# Altium schematic sheet CABLE_MOTOR_DRIVERS.SchDoc
size A; SheetNumber: 2; SheetTotal: 6
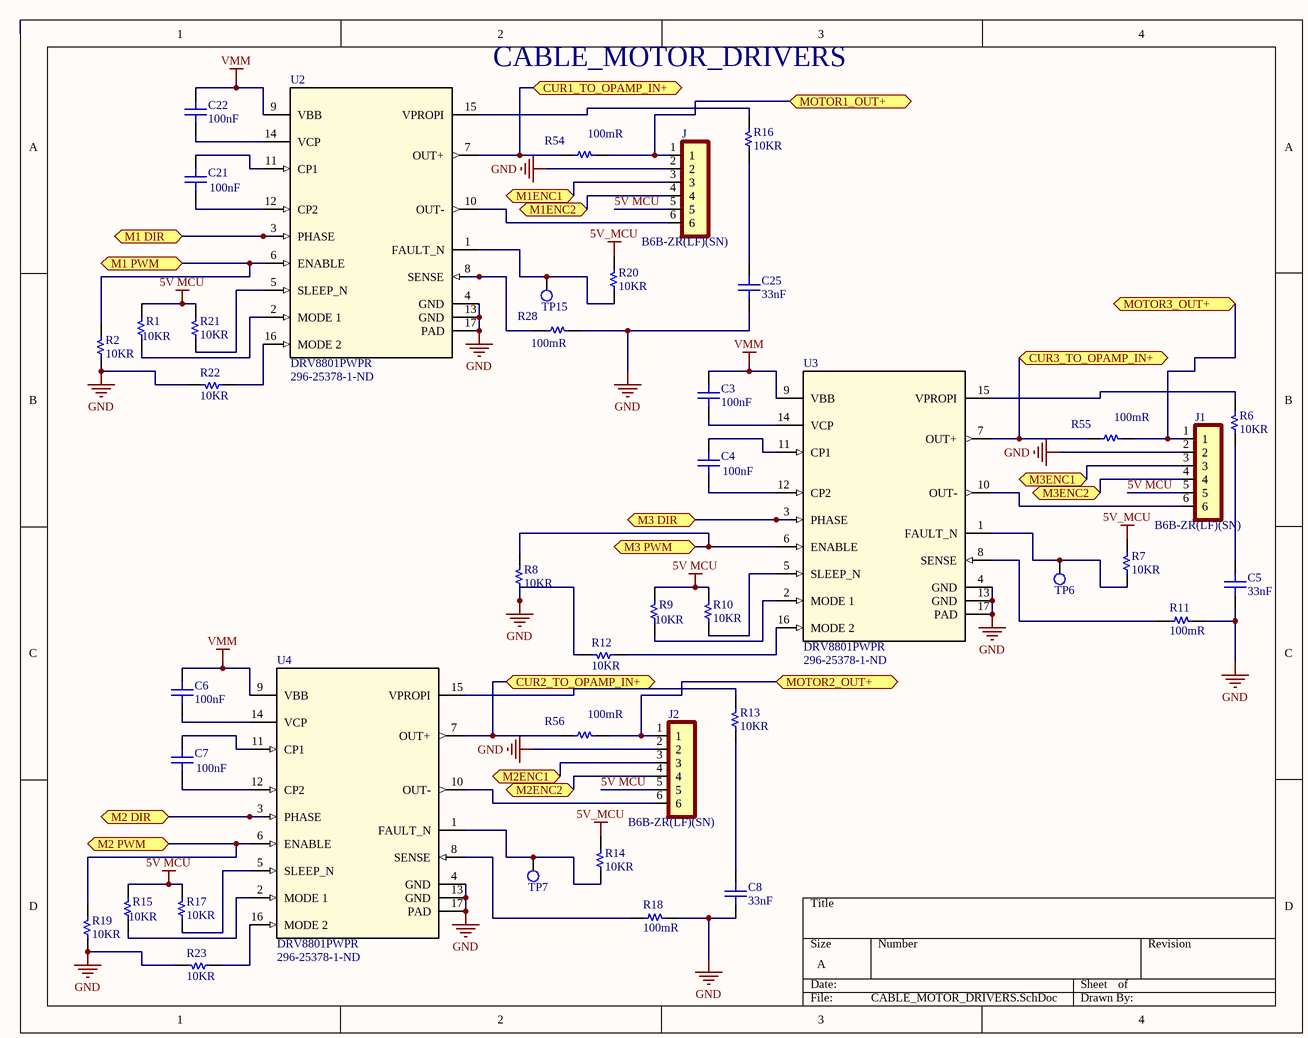
[diagram p0: CABLE_MOTOR_DRIVERS.SchDoc]

## Parts
C3  100nF  [CAP_ADJ_0805]
C4  100nF  [CAP_ADJ_0805]
C5  33nF  [CAP_ADJ_0805]
C6  100nF  [CAP_ADJ_0805]
C7  100nF  [CAP_ADJ_0805]
C8  33nF  [CAP_ADJ_0805]
C21  100nF  [CAP_ADJ_0805]
C22  100nF  [CAP_ADJ_0805]
C25  33nF  [CAP_ADJ_0805]
J  B6B-ZR(LF)(SN)  [JST_B6B-ZR(LF)(SN)]
J1  B6B-ZR(LF)(SN)  [JST_B6B-ZR(LF)(SN)]
J2  B6B-ZR(LF)(SN)  [JST_B6B-ZR(LF)(SN)]
R1  10KR  [RES_ADJ_0805_YAGEO]
R2  10KR  [RES_ADJ_0805_YAGEO]
R6  10KR  [RES_ADJ_0805_YAGEO]
R7  10KR  [RES_ADJ_0805_YAGEO]
R8  10KR  [RES_ADJ_0805_YAGEO]
R9  10KR  [RES_ADJ_0805_YAGEO]
R10  10KR  [RES_ADJ_0805_YAGEO]
R11  100mR  [RES_ADJ_0805_YAGEO]
R12  10KR  [RES_ADJ_0805_YAGEO]
R13  10KR  [RES_ADJ_0805_YAGEO]
R14  10KR  [RES_ADJ_0805_YAGEO]
R15  10KR  [RES_ADJ_0805_YAGEO]
R16  10KR  [RES_ADJ_0805_YAGEO]
R17  10KR  [RES_ADJ_0805_YAGEO]
R18  100mR  [RES_ADJ_0805_YAGEO]
R19  10KR  [RES_ADJ_0805_YAGEO]
R20  10KR  [RES_ADJ_0805_YAGEO]
R21  10KR  [RES_ADJ_0805_YAGEO]
R22  10KR  [RES_ADJ_0805_YAGEO]
R23  10KR  [RES_ADJ_0805_YAGEO]
R28  100mR  [RES_ADJ_0805_YAGEO]
R54  100mR  [RES_ADJ_0805_YAGEO]
R55  100mR  [RES_ADJ_0805_YAGEO]
R56  100mR  [RES_ADJ_0805_YAGEO]
TP6  TEST_POINT  [TEST_POINT]  (value not drawn)
TP7  TEST_POINT  [TEST_POINT]  (value not drawn)
TP15  TEST_POINT  [TEST_POINT]  (value not drawn)
U2  DRV8801PWPR  Supplier Part Number 1: 296-25378-1-ND  [PWP0016B_N]
U3  DRV8801PWPR  Supplier Part Number 1: 296-25378-1-ND  [PWP0016B_N]
U4  DRV8801PWPR  Supplier Part Number 1: 296-25378-1-ND  [PWP0016B_N]

## Ports
CUR1_TO_OPAMP_IN+ (bidir), CUR2_TO_OPAMP_IN+ (bidir), CUR3_TO_OPAMP_IN+ (bidir), M1 DIR (bidir), M1 PWM (bidir), M1ENC1 (bidir), M1ENC2 (bidir), M2 DIR (bidir), M2 PWM (bidir), M2ENC1 (bidir), M2ENC2 (bidir), M3 DIR (bidir), M3 PWM (bidir), M3ENC1 (bidir), M3ENC2 (bidir), MOTOR1_OUT+ (bidir), MOTOR2_OUT+ (bidir), MOTOR3_OUT+ (bidir)

## Nets
5V MCU: J.5 J1.5 J2.5 R1.2 R9.2 R10.2 R15.2 R17.2 R21.2
5V_MCU: R7.2 R14.2 R20.2
GND: C5.1 C8.1 C25.1 J.2 J1.2 J2.2 R2.1 R8.1 R11.2 R12.2 R18.2 R19.1 R22.2 R23.2 R28.2 U2.4(GND) U2.13(GND) U2.17(PAD) U3.4(GND) U3.13(GND) U3.17(PAD) U4.4(GND) U4.13(GND) U4.17(PAD)
VMM: C3.2 C6.2 C22.2 U2.9(VBB) U3.9(VBB) U4.9(VBB)
CUR1_TO_OPAMP_IN+: R54.1 U2.7(OUT+) ; port CUR1_TO_OPAMP_IN+
CUR2_TO_OPAMP_IN+: R56.1 U4.7(OUT+) ; port CUR2_TO_OPAMP_IN+
CUR3_TO_OPAMP_IN+: R55.1 U3.7(OUT+) ; port CUR3_TO_OPAMP_IN+
M1 DIR: U2.3(PHASE) ; port M1 DIR
M1 PWM: R2.2 U2.6(ENABLE) ; port M1 PWM
M1ENC1: J.3 ; port M1ENC1
M1ENC2: J.4 ; port M1ENC2
M2 DIR: U4.3(PHASE) ; port M2 DIR
M2 PWM: R19.2 U4.6(ENABLE) ; port M2 PWM
M2ENC1: J2.3 ; port M2ENC1
M2ENC2: J2.4 ; port M2ENC2
M3 DIR: U3.3(PHASE) ; port M3 DIR
M3 PWM: R8.2 U3.6(ENABLE) ; port M3 PWM
M3ENC1: J1.3 ; port M3ENC1
M3ENC2: J1.4 ; port M3ENC2
MOTOR1_OUT+: J.1 R54.2 ; port MOTOR1_OUT+
MOTOR2_OUT+: J2.1 R56.2 ; port MOTOR2_OUT+
MOTOR3_OUT+: J1.1 R55.2 ; port MOTOR3_OUT+
NetC3_1: C3.1 U3.14(VCP)
NetC4_1: C4.1 U3.12(CP2)
NetC4_2: C4.2 U3.11(CP1)
NetC5_2: C5.2 R6.1
NetC6_1: C6.1 U4.14(VCP)
NetC7_1: C7.1 U4.12(CP2)
NetC7_2: C7.2 U4.11(CP1)
NetC8_2: C8.2 R13.1
NetC21_1: C21.1 U2.12(CP2)
NetC21_2: C21.2 U2.11(CP1)
NetC22_1: C22.1 U2.14(VCP)
NetC25_2: C25.2 R16.1
NetJ1_6: J1.6 U3.10(OUT-)
NetJ2_6: J2.6 U4.10(OUT-)
NetJ_6: J.6 U2.10(OUT-)
NetR1_1: R1.1 U2.2(MODE_1)
NetR6_2: R6.2 U3.15(VPROPI)
NetR7_1: R7.1 TP6.1 U3.1(FAULT_N)
NetR9_1: R9.1 U3.2(MODE_1)
NetR10_1: R10.1 U3.5(SLEEP_N)
NetR11_1: R11.1 U3.8(SENSE)
NetR12_1: R12.1 U3.16(MODE_2)
NetR13_2: R13.2 U4.15(VPROPI)
NetR14_1: R14.1 TP7.1 U4.1(FAULT_N)
NetR15_1: R15.1 U4.2(MODE_1)
NetR16_2: R16.2 U2.15(VPROPI)
NetR17_1: R17.1 U4.5(SLEEP_N)
NetR18_1: R18.1 U4.8(SENSE)
NetR20_1: R20.1 TP15.1 U2.1(FAULT_N)
NetR21_1: R21.1 U2.5(SLEEP_N)
NetR22_1: R22.1 U2.16(MODE_2)
NetR23_1: R23.1 U4.16(MODE_2)
NetR28_1: R28.1 U2.8(SENSE)

## Notes on the sheet
- CABLE_MOTOR_DRIVERS

## Library data of the parts
C3 C4 C6 C7 C21 C22 = CAP_ADJ_0805: CERAMIC CAPACITOR SMD 0805; Manufacturer: KEMET; Manufacturer Part Number: C0805C104J5RACAUTO; Voltage Rating: 50V; Tolerance: 5%; Dielectric: X7R; Supplier 1: Digi-Key; Supplier Part Number 1: 399-6925-1-ND; Stock 1: 9661; Pricing 1: 1=0.22, 10=0.152, 100=0.0769, 500=0.0526, 1000=0.0466 (USD); Mount: Surface Mount; Case/Package: 0805; Case Code (Metric): 2012; Case Code (Imperial): 0805; Dielectric Material: Ceramic; Min Operating Temperature: -55°C; Max Operating Temperature: 125°C; Package Quantity: 1; Capacitance: 100nF; Packaging: Cut Tape; Voltage Rating (DC): 50V; Length: 0.079inch; Width: 0.049inch; Thickness: 0.035inch; Depth: 1.25mm; REACH SVHC: No SVHC; ComponentLink1URL: http://components.arrow.com/part/dataview/0323_00324161; ComponentLink1Description: http://components.arrow.com/part/dataview/0323_00324161; ComponentLink2URL: http://www.farnell.com/datasheets/2123421.pdf; ComponentLink2Description: http://www.farnell.com/datasheets/2123421.pdf; ComponentLink3URL: https://search.kemet.com/component-edge/download/datasheet/C0805C104J5RACAUTO.pdf; ComponentLink3Description: https://search.kemet.com/component-edge/download/datasheet/C0805C104J5RACAUTO.pdf
C5 C8 C25 = CAP_ADJ_0805: CERAMIC CAPACITOR SMD 0805; Manufacturer: Samsung; Manufacturer Part Number: CL21B333JBANNNC; Tolerance: 5%; Voltage Rating: 50V; Dielectric: X7R; Supplier 1: Digi-Key; Supplier Part Number 1: 1276-2505-1-ND; Stock 1: 12525; Pricing 1: 1=0.21, 10=0.151, 100=0.0711, 500=0.0499, 1000=0.0413 (USD); Mount: Surface Mount; Case/Package: 0805; Case Code (Metric): 2012; Case Code (Imperial): 0805; Min Operating Temperature: -55°C; Max Operating Temperature: 125°C; Capacitance: 33nF; Packaging: Tape and Reel; Package Quantity: 1; Voltage: 50V; Voltage Rating (DC): 50V; Length: 2mm; Height: 0.65mm; Width: 0.049inch; Thickness: 0.03inch; Depth: 1.25mm; Radiation Hardening: No; ComponentLink1URL: https://datasheet.ciiva.com/26838/getdatasheetpartid-356482-26838724.pdf; ComponentLink1Description: https://datasheet.ciiva.com/26838/getdatasheetpartid-356482-26838724.pdf; ComponentLink2URL: https://datasheet.ciiva.com/25728/cl21b333jbannnc-25728473.pdf; ComponentLink2Description: https://datasheet.ciiva.com/25728/cl21b333jbannnc-25728473.pdf
J J1 J2 = B6B-ZR(LF)(SN): Connector Header Through Hole 6 position 0.059 _1.50mm_; MF: JST Sales; MP: B6B-ZR_LF__SN_; Package: None; Price: None; SnapEDA_Link: https://www.snapeda.com/parts/B6B-ZR%28LF%29%28SN%29/JST%20Sales%20America%20Inc./view-part/279441/?ref=snap; Availability: Unavailable; Value: *
R1 R2 R6-R10 R12-R17 R19-R23 = RES_ADJ_0805: RESISTOR 0805 YAGEO; Manufacturer Part Number: RC0805JR-0710KL; Tolerance: 5%; Temperature Coefficient: 100ppm/°C; Power Rating: 125mW; Voltage Rating: 150V; Value: *; Supplier 1: Digi-Key; Supplier Part Number 1: 311-10KARDKR-ND; Manufacturer: Yageo; Stock 1: 1589050; Pricing 1: 1=0.1, 10=0.019, 100=0.0076, 1000=0.0034, 2500=0.003 (USD); Case/Package: 0805; Contact Plating: Tin,Matte; Case Code (Imperial): 0805; Case Code (Metric): 2012; Min Operating Temperature: -55°C; Max Operating Temperature: 155°C; Resistance: 10KR; Packaging: Tape and Reel; Composition: Thick Film; Termination: SMD/SMT; Military Standard: Not; Length: 2mm; Height: 0.5mm; Width: 1.25mm; Depth: 1.25mm; Radiation Hardening: No; REACH SVHC: Unknown; Lead Free: Lead Free; ComponentLink1URL: https://datasheet.ciiva.com/7983/444164-7983765.pdf; ComponentLink1Description: https://datasheet.ciiva.com/7983/444164-7983765.pdf; ComponentLink2URL: https://datasheet.ciiva.com/7941/444164-7941870.pdf; ComponentLink2Description: https://datasheet.ciiva.com/7941/444164-7941870.pdf; ComponentLink3URL: https://datasheet.ciiva.com/7941/444164-7941871.pdf; ComponentLink3Description: https://datasheet.ciiva.com/7941/444164-7941871.pdf
R11 R18 R28 R54-R56 = RES_ADJ_0805: RESISTOR 0805 YAGEO; Manufacturer: Panasonic; Manufacturer Part Number: ERJ-6DSFR10V; Tolerance: 1%; Max Power Dissipation: 500mW; Temperature Coefficient: 150ppm/°C; Supplier 1: Digi-Key; Supplier Part Number 1: P19308CT-ND; Stock 1: 16904; Pricing 1: 1=0.5, 10=0.36, 25=0.266, 50=0.196, 100=0.1438, 250=0.1188, 500=0.098, 1000=0.0709 (USD); Case/Package: 0805; Case Code (Metric): 2012; Case Code (Imperial): 0805; Min Operating Temperature: -55°C; Max Operating Temperature: 155°C; Packaging: Cut Tape; Resistance: 100mR; Composition: Thick Film; Number of Terminations: 2; Length: 0.079inch; Height: 0.028inch; Width: 0.049inch; ComponentLink1URL: https://industrial.panasonic.com/cdbs/www-data/pdf/RDN0000/AOA0000C313.pdf; ComponentLink1Description: https://industrial.panasonic.com/cdbs/www-data/pdf/RDN0000/AOA0000C313.pdf
TP6 TP7 TP15 = TEST_POINT: TEST POINT PAD
U2-U4 = DRV8801PWPR: IC MOTOR DRIVER PAR 16HTSSOP; Manufacturer: Texas Instruments; Max Supply Voltage: 38V; Min Supply Voltage: 8V; Output Current: 2.8A; Nominal Supply Current: 6mA; Logic Function: AND; Quiescent Current: 3.2mA; Operating Supply Voltage: 36V; Number of Outputs: 1; Interface: Parallel; Supplier 1: Digi-Key; Manufacturer Part Number: DRV8801PWPR; Stock 1: 45192; Pricing 1: 1=2.65, 10=2.377, 100=1.9109, 500=1.57, 1000=1.3008 (USD); Mount: Surface Mount; Case/Package: HTSSOP EP; Number of Pins: 16; Weight: 0.002212oz; Min Operating Temperature: -40°C; Max Operating Temperature: 85°C; Packaging: Tape and Reel; Package Quantity: 2000; Radiation Hardening: No; Lead Free: Lead Free; REACH SVHC: No SVHC; ComponentLink1URL: https://datasheet.ciiva.com/1958/drv8801-1958736.pdf; ComponentLink1Description: https://datasheet.ciiva.com/1958/drv8801-1958736.pdf; ComponentLink2URL: https://datasheet.ciiva.com/1958/drv8801-1958737.pdf; ComponentLink2Description: https://datasheet.ciiva.com/1958/drv8801-1958737.pdf; ComponentLink3URL: https://datasheet.ciiva.com/15109/getdatasheetpartid-362071-15109493.pdf; ComponentLink3Description: https://datasheet.ciiva.com/15109/getdatasheetpartid-362071-15109493.pdf; ComponentLink4URL: https://datasheet.ciiva.com/26086/drv8801-26086021.pdf; ComponentLink4Description: https://datasheet.ciiva.com/26086/drv8801-26086021.pdf; ComponentLink5URL: https://datasheet.ciiva.com/3229/drv8801-3229006.pdf; ComponentLink5Description: https://datasheet.ciiva.com/3229/drv8801-3229006.pdf; ComponentLink6URL: https://datasheet.ciiva.com/1958/drv8801-1958735.pdf; ComponentLink6Description: https://datasheet.ciiva.com/1958/drv8801-1958735.pdf; ComponentLink7URL: https://datasheet.ciiva.com/41457/001013558-da-01-en-ic-motor-driver-drv8801pwpr-tssop-16-tid-41457316.pdf; ComponentLink7Description: https://datasheet.ciiva.com/41457/001013558-da-01-en-ic-motor-driver-drv8801pwpr-tssop-16-tid-41457316.pdf